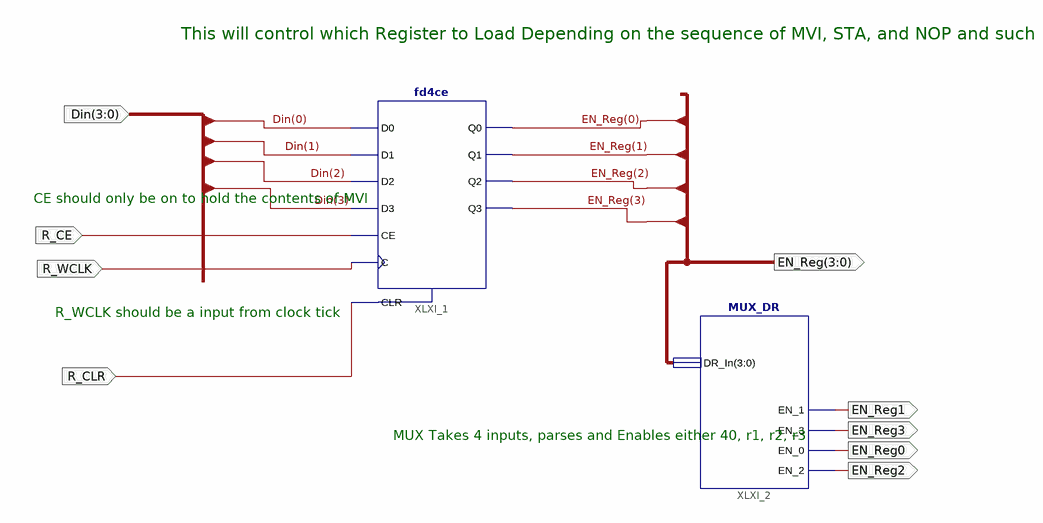
[diagram p0: schematic sheet 1]
// Xilinx ISE schematic Register_4bBit.sch (spartan3e) as structural Verilog: 2 symbols, 9 ports
module Register_4bBit (
  input  [3:0] Din,
  input  R_WCLK,
  input  R_CE,
  input  R_CLR,
  output [3:0] EN_Reg,
  output EN_Reg1,
  output EN_Reg3,
  output EN_Reg0,
  output EN_Reg2
);

  fd4ce XLXI_1 (
    .C(R_WCLK), .CE(R_CE), .CLR(R_CLR), .D0(Din[0]), .D1(Din[1]), .D2(Din[2]), .D3(Din[3]), .Q0(EN_Reg[0]),
    .Q1(EN_Reg[1]), .Q2(EN_Reg[2]), .Q3(EN_Reg[3]));
  MUX_DR XLXI_2 (.DR_In(EN_Reg), .EN_1(EN_Reg1), .EN_3(EN_Reg3), .EN_0(EN_Reg0), .EN_2(EN_Reg2));

  // Notes on the sheet:
  //   This will control which Register to Load Depending on the sequence of MVI, STA, and NOP and such
  //   CE should only be on to hold the contents of MVI
  //   R_WCLK should be a input from clock tick
  //   MUX Takes 4 inputs, parses and Enables either 40, r1, r2, r3
endmodule
